# Altium schematic sheet WCE_Battery_Bottom.SchDoc
size A; SheetNumber: 1; SheetTotal: 1
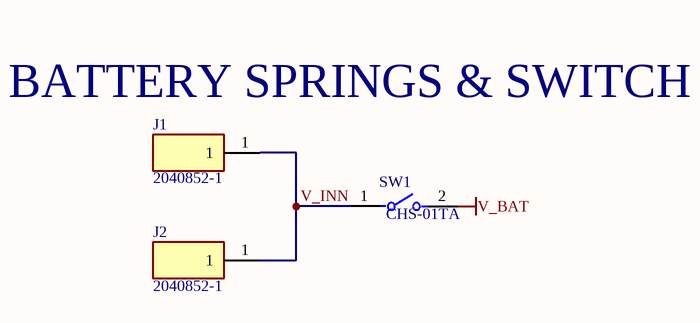
[diagram p0: WCE_Battery_Bottom.SchDoc]

## Parts
J1  2040852-1  [2040852-1]
J2  2040852-1  [2040852-1]
SW1  CHS-01TA  [FP-CHS-01TA-MFG]

## Nets
V_BAT: SW1.2
V_INN: J1.1 J2.1 SW1.1

## Notes on the sheet
- (near J1) BATTERY SPRINGS & SWITCH

## Library data of the parts
J1 J2 = 2040852-1: TE connectivity 2040852-1 PCB Spring Contact
SW1 = CMP-71740-000003-1: SWITCH SLIDE DIP SPST 100MA 6V; Manufacturer: Nidec Copal Electronics; Contact Resistance: 50mΩ; Standoff Height: 0mm; Number Of Circuits: 1; Electromechanical Life: 2000Cycles; Device Class L1: Electromechanical; Device Class L2: Switches; Category: Switch; Temperature Range Low: -40°C; Device Class L3: DIP Switches; Height: 2.5mm; Lead Free: Yes; Octopart: https://octopart.com/chs-01ta-nidec+copal-52304644; Throw Configuration: SPST; Package: CHS-01TA; Voltage Rating Dc: 6V; Digikey Description: SWITCH SLIDE DIP SPST 100MA 6V; Mount: Surface Mount; Automotive: No; Contact Current Rating: 100mA; ComponentLink2URL: https://www.nidec-copal-electronics.com/e/catalog/switch/chs.pdf; ComponentLink2Description: Datasheet; Temperature: -40°C to +85°C; Temperature Range High: +85°C; RoHS: TRUE; Manufacturer Part Number: CHS-01TA